# EasyEDA Pro project ProPrj_6dof2_fixed.epro

# Schematic Schematic1
Board Name: Board1; Create Date: 2026-02-27; Page Name: P1; Project Name: 6dof2; Schematic Name: Schematic1; Update Date: 2026-02-27; Company: EasyEDA.com; Page Size: A4; Version: V1.0
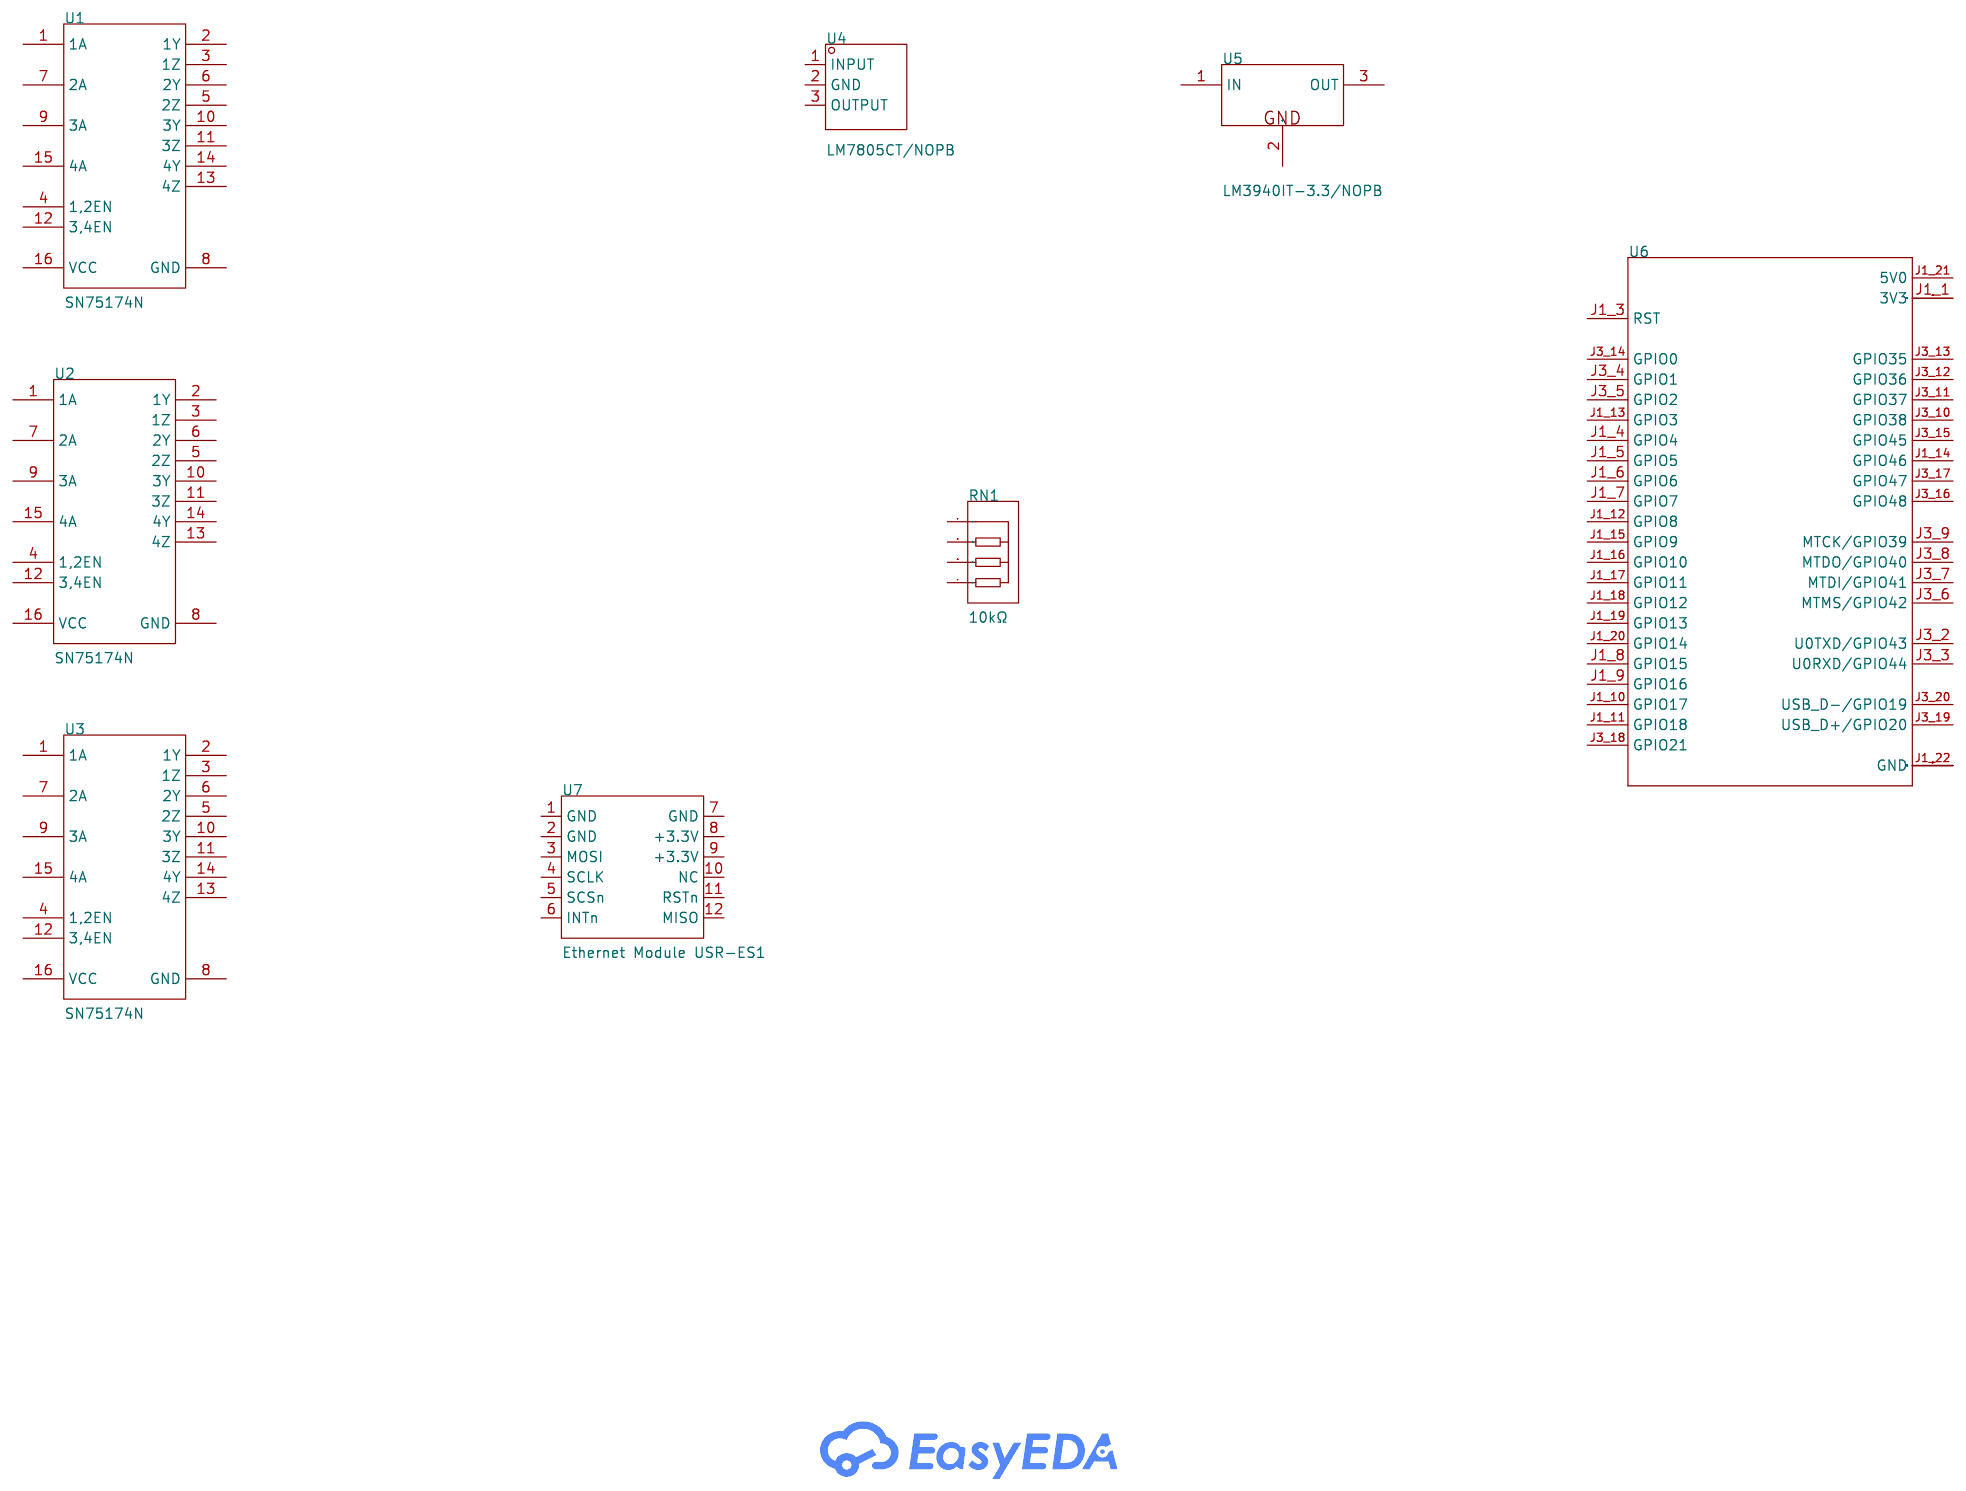
[diagram p0: schematic sheet]

## Parts
RN1  10kΩ  [RES-ARRAY-TH_4P-P2.54-D1.0]
U1  SN75174N  [DIP-16_L20.0-W6.4-P2.54-LS7.6-BL]
U2  SN75174N  [DIP-16_L20.0-W6.4-P2.54-LS7.6-BL]
U3  SN75174N  [DIP-16_L20.0-W6.4-P2.54-LS7.6-BL]
U4  LM7805CT/NOPB  [TO-220-3_L10.0-W4.5-P2.54-T]
U5  LM3940IT-3.3/NOPB  [TO-220-3_L10.2-W4.6-P2.54-L]
U6  -  [XCVR_ESP32-S3-DEVKITC-1-N8R2]
U7  Ethernet Module USR-ES1  [COMM_ETHERNET-MODULE-USR-ES1]

## Library data of the parts
RN1 = 4604X-101-103LF: Number of Resistors: Resistance:10kΩ Tolerance:±2% Tolerance:±2% Power(Watts):200mW Temperature Coefficient:±100ppm/℃ Temperature Coefficient:±100ppm/℃ Number of Pins:; LCSC Part Name: 10kΩ ±2%; Supplier Part: C1358483; Manufacturer: BOURNS; Supplier Footprint: SIP-4-2.54mm; JLCPCB Part Class: Extended Part; Datasheet: https://item.szlcsc.com/datasheet/4604X-101-103LF/1448770.html; Supplier: LCSC; Tolerance: ±2%; Power(Watts): 200mW; Temperature Coefficient: ±100ppm/℃
U1-U3 = SN75174N: Types:Driver Number of Driver:4 Number of receiver:0 Supply Voltage:4.75V~5.25V Supply Voltage:4.75V~5.25V Operating Temperature:0℃~+70℃ Operating Temperature:0℃~+70℃; LCSC Part Name: 四通道差分线驱动器; Supplier Part: C77813; Manufacturer: TI(德州仪器); Supplier Footprint: DIP-16; JLCPCB Part Class: Extended Part; Datasheet: https://www.ti.com/cn/lit/gpn/sn75174; Supplier: LCSC; Types: Driver; Number of Driver: 4; Number of receiver: 0; Supply Voltage: 4.75V~5.25V; Operating Temperature: 0℃~+70℃
U4 = LM7805CT/NOPB: Output Type:Fixed Voltage - Supply:20V Output Voltage:5V Output Voltage:5V Output Current:1A Power Supply Rejection Ratio (PSRR):62dB@(120Hz) Voltage Dropout:2V@(1A) standby current:8mA Noise:40uV Features:Short Circuit Protection；Over Temperature Protect; LCSC Part Name: 1.5A、30V 线性稳压器; Supplier Part: C50931; Manufacturer: TI(德州仪器); Supplier Footprint: TO-220; JLCPCB Part Class: Extended Part; Datasheet: https://www.ti.com/cn/lit/gpn/lm7800; Supplier: LCSC; Output Type: Fixed; Voltage - Supply: 20V; Output Voltage: 5V; Output Current: 1A; Power Supply Rejection Ratio (PSRR): 62dB@(120Hz); Voltage Dropout: 2V@(1A); standby current: 8mA; Noise: 40uV; Features: Short Circuit Protection；Over Temperature Protection；Over Current Protection; Operating Temperature: 0℃~+70℃@(Ta); Output Configuration: Positive; Number of Outputs: 1
U5 = LM3940IT-3.3/NOPB: Output Type:Fixed Voltage - Supply:7.5V Output Voltage:3.3V Output Voltage:3.3V Output Current:1A Voltage Dropout:200mV@(100mA) Operating Temperature:-40℃~+125℃ Operating Temperature:-40℃~+125℃ Output Configuration:Positive electrode Number of Outputs:1; LCSC Part Name: 用于 5V 至 3.3V 电压转换的 1A 低压降稳压器; Supplier Part: C2863697; Manufacturer: TI(德州仪器); Supplier Footprint: TO-220; JLCPCB Part Class: Extended Part; Datasheet: https://www.ti.com/cn/lit/gpn/lm3940; Supplier: LCSC; Output Type: Fixed; Voltage - Supply: 7.5V; Output Voltage: 3.3V; Output Current: 1A; Voltage Dropout: 200mV@(100mA); Operating Temperature: -40℃~+125℃; Output Configuration: Positive electrode; Number of Outputs: 1
U6 = ESP32-S3-DEVKITC-1-N8R2
U7 = Ethernet Module USR-ES1: Supplier Part: C9900201496; Supplier Footprint: Through hole; JLCPCB Part Class: Extended Part; Supplier: LCSC

## Nets
Net-(U6-J1_1): U6.J1_1(3V3) U6.J1_2(3V3)
Net-(U6-J1_22): U6.J1_22(GND) U6.J3_1(GND) U6.J3_21(GND) U6.J3_22(GND)

Not connected (* = marked no-connect by the designer): RN1 1 2 3 4; U1 1(1A) 2(1Y) 3(1Z) 4(1,2EN) 5(2Z) 6(2Y) 7(2A) 8(GND) 9(3A) 10(3Y) 11(3Z) 12(3,4EN) 13(4Z) 14(4Y) 15(4A) 16(VCC); U2 1(1A) 2(1Y) 3(1Z) 4(1,2EN) 5(2Z) 6(2Y) 7(2A) 8(GND) 9(3A) 10(3Y) 11(3Z) 12(3,4EN) 13(4Z) 14(4Y) 15(4A) 16(VCC); U3 1(1A) 2(1Y) 3(1Z) 4(1,2EN) 5(2Z) 6(2Y) 7(2A) 8(GND) 9(3A) 10(3Y) 11(3Z) 12(3,4EN) 13(4Z) 14(4Y) 15(4A) 16(VCC); U4 1(INPUT) 2(GND) 3(OUTPUT); U5 1(IN) 2(GND) 3(OUT); U6 J1_3(RST) J1_4(GPIO4) J1_5(GPIO5) J1_6(GPIO6) J1_7(GPIO7) J1_8(GPIO15) J1_9(GPIO16) J1_10(GPIO17) J1_11(GPIO18) J1_12(GPIO8) J1_13(GPIO3) J1_14(GPIO46) J1_15(GPIO9) J1_16(GPIO10) J1_17(GPIO11) J1_18(GPIO12) J1_19(GPIO13) J1_20(GPIO14) J1_21(5V0) J3_2(U0TXD/GPIO43) J3_3(U0RXD/GPIO44) J3_4(GPIO1) J3_5(GPIO2) J3_6(MTMS/GPIO42) J3_7(MTDI/GPIO41) J3_8(MTDO/GPIO40) J3_9(MTCK/GPIO39) J3_10(GPIO38) J3_11(GPIO37) J3_12(GPIO36) J3_13(GPIO35) J3_14(GPIO0) J3_15(GPIO45) J3_16(GPIO48) J3_17(GPIO47) J3_18(GPIO21) J3_19(USB_D+/GPIO20) J3_20(USB_D-/GPIO19); U7 1(GND) 2(GND) 3(MOSI) 4(SCLK) 5(SCSn) 6(INTn) 7(GND) 8(+3.3V) 9(+3.3V) 10(NC) 11(RSTn) 12(MISO)
